# EAGLE design SharkBait (EAGLE 7.1.0)
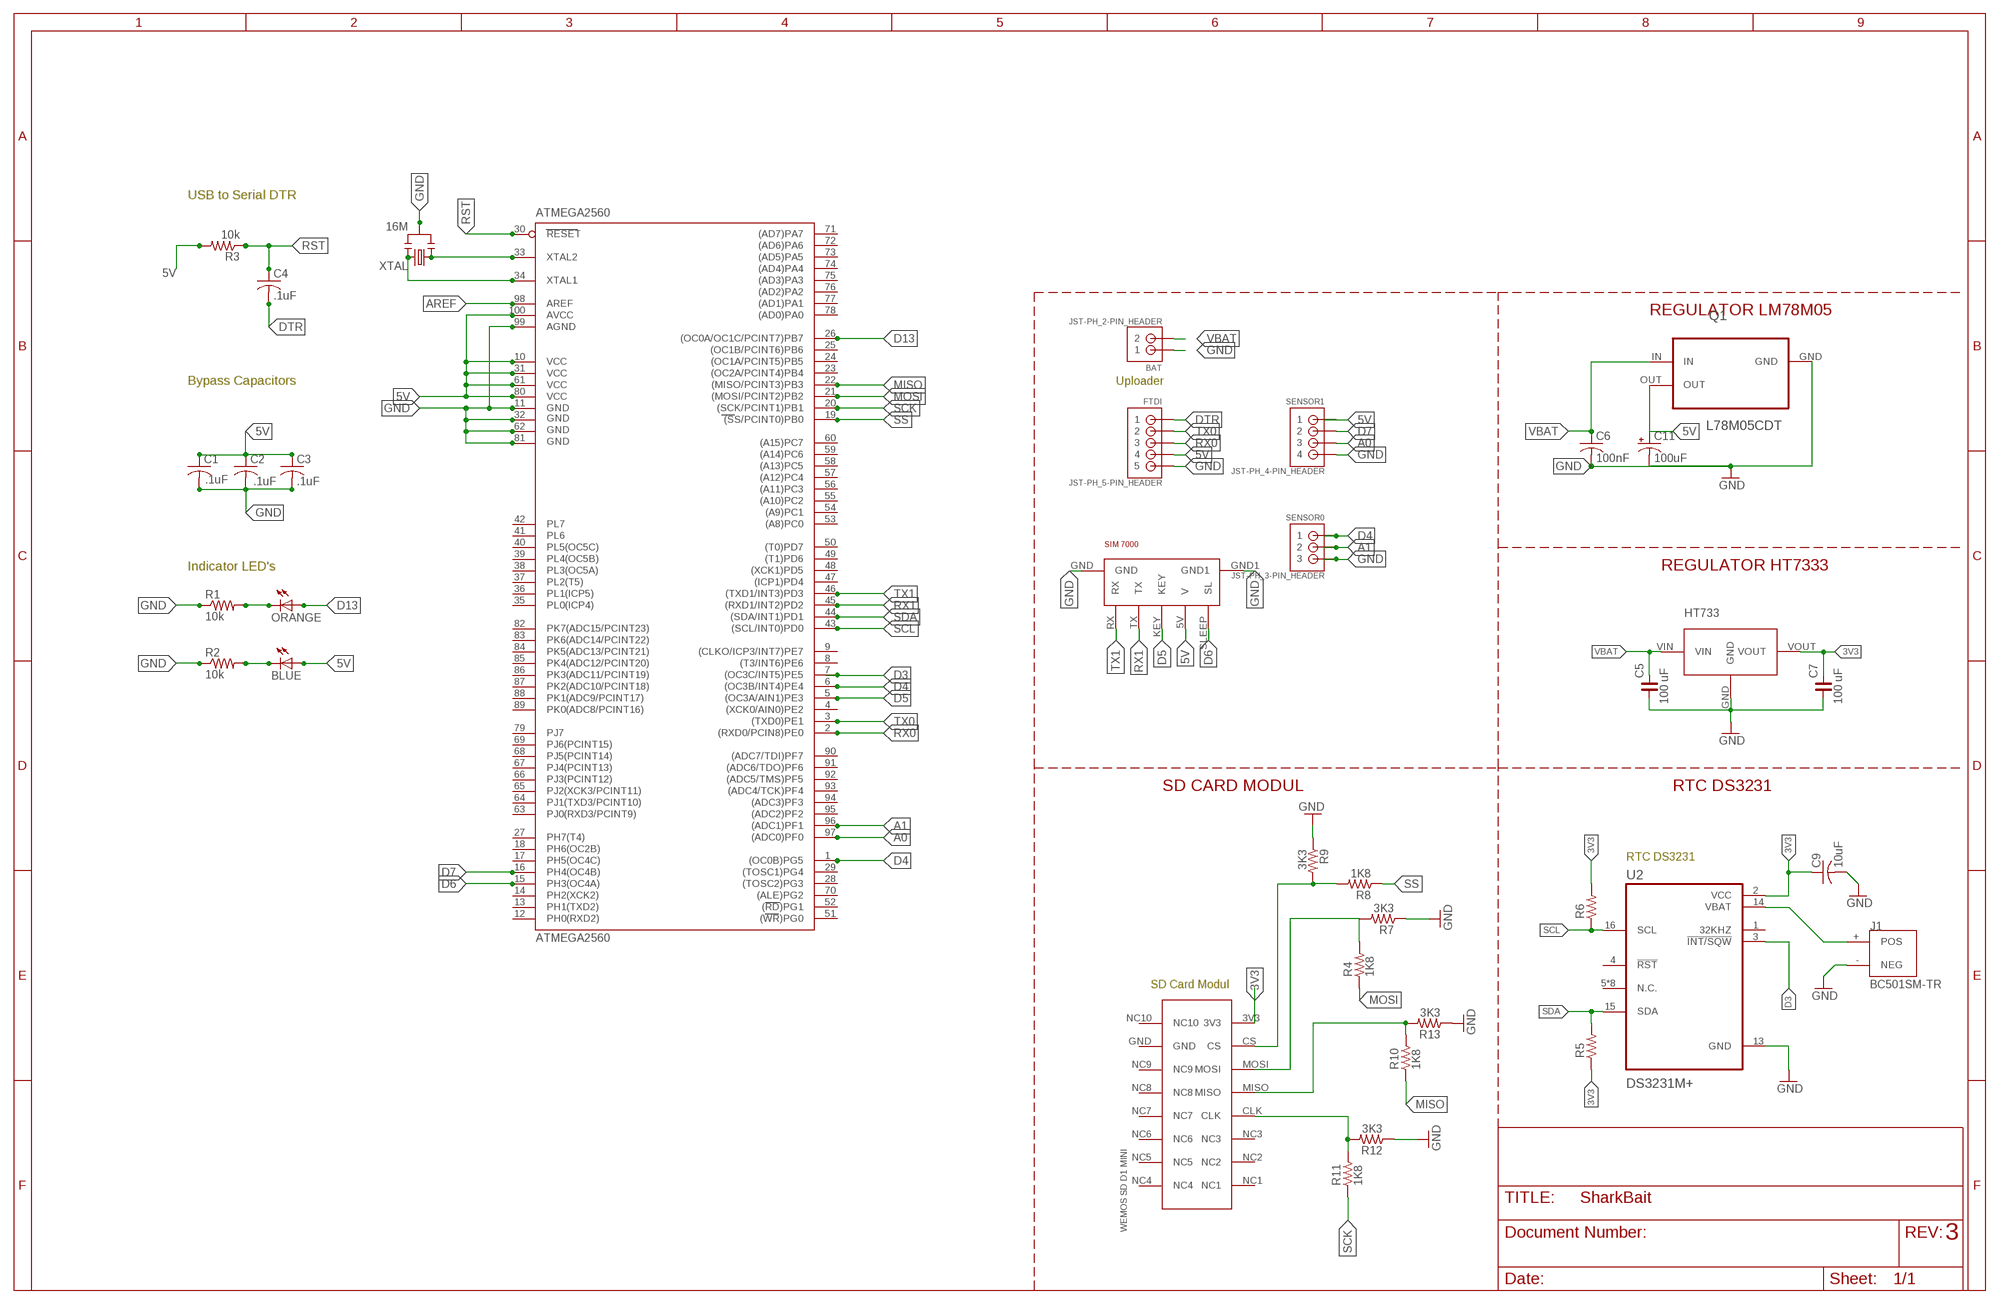
[diagram p0: schematic, sheet 1]

## Parts
ATMEGA2560  ATMEGA2560  [TQFP100]
BAT  JST-PH_2-PIN_HEADER  [JST_B2B-PH_HEADER]
BLUE  L  LED-SMD-0805  [SMD-0805-LED]
C1  CAPACITOR-SMD-0805  [SMD-0805]
C2  .1uF  CAPACITOR-SMD-0805  [SMD-0805]
C3  .1uF  CAPACITOR-SMD-0805  [SMD-0805]
C4  .1uF  CAPACITOR-SMD-0805  [SMD-0805]
C5  100 uF  C_0805  [C0805]
C6  100nF  C-USC1206  [C1206]
C7  100 uF  C_0805  [C0805]
C9  10uF  CAPACITOR-SMD-0805  [SMD-0805]
C11  100uF  CPOL-USD  [PANASONIC_D]
FTDI  JST-PH_5-PIN_HEADER  [JST_B5B-PH_HEADER]
HT733  HT7333  [SOT89]
J1  BC501SM-TR  [MPD_BC501SM-TR]
ORANGE  L  LED-SMD-0805  [SMD-0805-LED]
Q1  L78M05CDT  [TO225P972X240-3N]
R1  10k  RESISTOR-SMD-0805  [SMD-0805]
R2  10k  RESISTOR-SMD-0805  [SMD-0805]
R3  10k  RESISTOR-SMD-0805  [SMD-0805]
R4  1K8  R_0805  [R0805]
R5  R_0805  [R0805]
R6  R_0805  [R0805]
R7  3K3  R_0805  [R0805]
R8  1K8  R_0805  [R0805]
R9  3K3  R_0805  [R0805]
R10  1K8  R_0805  [R0805]
R11  1K8  R_0805  [R0805]
R12  3K3  R_0805  [R0805]
R13  3K3  R_0805  [R0805]
SENSOR0  JST-PH_3-PIN_HEADER  [JST_B3B-PH_HEADER]
SENSOR1  JST-PH_4-PIN_HEADER  [JST_B4B-PH_HEADER]
U2  DS3231M+  [SOIC127P1032X265-16N]
U$1  WEMOS_SD_D1_MINI  [WEMOS_SD_D1_MINI]
U$2  SIM7000  [SIM_7000]
XTAL  16M  RESONATOR  [RESONATOR]

## Nets
3V3: C7.2 C9.1 HT733.VOUT R5.1 R6.2 U2.2(VCC) U$1.3V3
5V: ATMEGA2560.10(VCC) ATMEGA2560.31(VCC1) ATMEGA2560.61(VCC2) ATMEGA2560.80(VCC3) ATMEGA2560.100(AVCC) BLUE.1(A) C1.1 C2.1 C3.1 C11.+ FTDI.P4 Q1.OUT R3.2 SENSOR1.P1 U$2.5V(V)
A0: ATMEGA2560.97((ADC0)PF0) SENSOR1.P3
A1: ATMEGA2560.96((ADC1)PF1) SENSOR0.P2
AREF: ATMEGA2560.98(AREF)
D3: ATMEGA2560.7((OC3C/INT5)PE5) U2.3(!INT/SQW)
D4: ATMEGA2560.1((OC0B)PG5) ATMEGA2560.6((OC3B/INT4)PE4) SENSOR0.P1
D5: ATMEGA2560.5((OC3A/AIN1)PE3) U$2.KEY
D6: ATMEGA2560.15(PH3(OC4A)) U$2.SLEEP(SL)
D7: ATMEGA2560.16(PH4(OC4B)) SENSOR1.P2
D13: ATMEGA2560.26((OC0A/OC1C/PCINT7)PB7) ORANGE.1(A)
DTR: C4.2 FTDI.P1
GND: ATMEGA2560.11(GND) ATMEGA2560.32(GND1) ATMEGA2560.62(GND2) ATMEGA2560.81(GND3) ATMEGA2560.99(AGND) BAT.P1 C1.2 C2.2 C3.2 C5.1 C6.2 C7.1 C9.2 C11.- FTDI.P5 HT733.GND J1.-(NEG) Q1.GND R1.1 R2.1 R7.1 R9.1 R12.1 R13.1 SENSOR0.P3 SENSOR1.P4 U2.13(GND) U$2.GND U$2.GND1 XTAL.2
MISO: ATMEGA2560.22((MISO/PCINT3)PB3) R10.1 R10.2 R13.2 U$1.MISO
MOSI: ATMEGA2560.21((MOSI/PCINT2)PB2) R4.1
N$1: J1.+(POS) U2.14(VBAT)
N$3: R4.2 R7.2 U$1.MOSI
N$13: ATMEGA2560.34(XTAL1) XTAL.3
N$81: ATMEGA2560.33(XTAL2) XTAL.1
N$82: ORANGE.2(C) R1.2
N$83: BLUE.2(C) R2.2
RST: ATMEGA2560.30(RESET) C4.1 R3.1
RX0: ATMEGA2560.2((RXD0/PCIN8)PE0) FTDI.P3
RX1: ATMEGA2560.45((RXD1/INT2)PD2) U$2.TX
SCK: ATMEGA2560.20((SCK/PCINT1)PB1) R11.1 R11.2 R12.2 U$1.CLK
SCK1: R8.2 R9.2 U$1.CS
SCL: ATMEGA2560.43((SCL/INT0)PD0) R6.1 U2.16(SCL)
SDA: ATMEGA2560.44((SDA/INT1)PD1) R5.2 U2.15(SDA)
SS: ATMEGA2560.19((SS/PCINT0)PB0) R8.1
TX0: ATMEGA2560.3((TXD0)PE1) FTDI.P2
TX1: ATMEGA2560.46((TXD1/INT3)PD3) U$2.RX
VBAT: BAT.P2 C5.2 C6.1 HT733.VIN Q1.IN
Unconnected: ATMEGA2560.4((XCK0/AIN0)PE2) ATMEGA2560.8((T3/INT6)PE6) ATMEGA2560.9((CLKO/ICP3/INT7)PE7) ATMEGA2560.12(PH0(RXD2)) ATMEGA2560.13(PH1(TXD2)) ATMEGA2560.14(PH2(XCK2)) ATMEGA2560.17(PH5(OC4C)) ATMEGA2560.18(PH6(OC2B)) ATMEGA2560.23((OC2A/PCINT4)PB4) ATMEGA2560.24((OC1A/PCINT5)PB5) ATMEGA2560.25((OC1B/PCINT6)PB6) ATMEGA2560.27(PH7(T4)) ATMEGA2560.28((TOSC2)PG3) ATMEGA2560.29((TOSC1)PG4) ATMEGA2560.35(PL0(ICP4)) ATMEGA2560.36(PL1(ICP5)) ATMEGA2560.37(PL2(T5)) ATMEGA2560.38(PL3(OC5A)) ATMEGA2560.39(PL4(OC5B)) ATMEGA2560.40(PL5(OC5C)) ATMEGA2560.41(PL6) ATMEGA2560.42(PL7) ATMEGA2560.47((ICP1)PD4) ATMEGA2560.48((XCK1)PD5) ATMEGA2560.49((T1)PD6) ATMEGA2560.50((T0)PD7) ATMEGA2560.51((WR)PG0) ATMEGA2560.52((RD)PG1) ATMEGA2560.53((A8)PC0) ATMEGA2560.54((A9)PC1) ATMEGA2560.55((A10)PC2) ATMEGA2560.56((A11)PC3) ATMEGA2560.57((A12)PC4) ATMEGA2560.58((A13)PC5) ATMEGA2560.59((A14)PC6) ATMEGA2560.60((A15)PC7) ATMEGA2560.63(PJ0(RXD3/PCINT9)) ATMEGA2560.64(PJ1(TXD3/PCINT10)) ATMEGA2560.65(PJ2(XCK3/PCINT11)) ATMEGA2560.66(PJ3(PCINT12)) ATMEGA2560.67(PJ4(PCINT13)) ATMEGA2560.68(PJ5(PCINT14)) ATMEGA2560.69(PJ6(PCINT15)) ATMEGA2560.70((ALE)PG2) ATMEGA2560.71((AD7)PA7) ATMEGA2560.72((AD6)PA6) ATMEGA2560.73((AD5)PA5) ATMEGA2560.74((AD4)PA4) ATMEGA2560.75((AD3)PA3) ATMEGA2560.76((AD2)PA2) ATMEGA2560.77((AD1)PA1) ATMEGA2560.78((AD0)PA0) ATMEGA2560.79(PJ7) ATMEGA2560.82(PK7(ADC15/PCINT23)) ATMEGA2560.83(PK6(ADC14/PCINT22)) ATMEGA2560.84(PK5(ADC13/PCINT21)) ATMEGA2560.85(PK4(ADC12/PCINT20)) ATMEGA2560.86(PK3(ADC11/PCINT19)) ATMEGA2560.87(PK2(ADC10/PCINT18)) ATMEGA2560.88(PK1(ADC9/PCINT17)) ATMEGA2560.89(PK0(ADC8/PCINT16)) ATMEGA2560.90((ADC7/TDI)PF7) ATMEGA2560.91((ADC6/TDO)PF6) ATMEGA2560.92((ADC5/TMS)PF5) ATMEGA2560.93((ADC4/TCK)PF4) ATMEGA2560.94((ADC3)PF3) ATMEGA2560.95((ADC2)PF2) U2.1(32KHZ) U2.4(!RST) U2.5(N.C.) U2.6(N.C.) U2.7(N.C.) U2.8(N.C.) U2.9(N.C.) U2.10(N.C.) U2.11(N.C.) U2.12(N.C.) U$1.GND U$1.NC1 U$1.NC2 U$1.NC3 U$1.NC4 U$1.NC5 U$1.NC6 U$1.NC7 U$1.NC8 U$1.NC9 U$1.NC10

## Notes on the sheet
- USB to Serial DTR
- REGULATOR LM78M05
- Bypass Capacitors | Uploader
- .1uF
- Indicator LED's | REGULATOR HT7333
- SD CARD MODUL | RTC DS3231
- RTC DS3231
- SD Card Modul
- 3

## Library data of the parts
ATMEGA2560 = Fuzzy:ATMEGA2560
BAT = srg:JST-PH_2-PIN_HEADER: 2-pin JST PH Shrouded Header, top entry P/N B2B-PH-K-S Mating connector PHR-2 Mating cable assembly: Sparkfun PRT-09914 <http://www.sparkfun.com/products/9914>
BLUE ORANGE = Fuzzy:LED-SMD-0805
C1-C4 C9 = Fuzzy:CAPACITOR-SMD-0805
C5 C7 = rc-master-smd:C_: NON-POLARIZED CAP
C6 = rcl:C-US: CAPACITOR, American symbol
C11 = rcl:CPOL-US: POLARIZED CAPACITOR, American symbol
FTDI = srg:JST-PH_5-PIN_HEADER: 5-pin JST PH Shrouded Header, top entry P/N B5B-PH-K-S Mating connector PHR-5 Mating cable assembly: Sparkfun PRT-09917 <http://www.sparkfun.com/products/9917>
HT733 = C_HT7333_SOT89:HT7333
J1 = C_BC501SM-TR:BC501SM-TR: Holder Coin Cell For Cr1220 Smd; AVAILABILITY: Unavailable; DESCRIPTION: Holder Coin Cell For Cr1220 Smd; MF: MPD _Memory; MP: BC501SM-TR; PACKAGE: DFN-8 MPD; PRICE: None
Q1 = C_L78M05CDT:L78M05CDT: Positive voltage regulators; AVAILABILITY: Unavailable; DESCRIPTION: L78M Series 500 mA 5 V Three Terminal Positive Voltage LDO Regulator - TO-252; MF: STMicroelectronics; MP: L78M05CDT-TR; PACKAGE: TO-252-3 STMicroelectronics; PRICE: None
R1-R3 = Fuzzy:RESISTOR-SMD-0805
R4-R13 = rc-master-smd:R_: RESISTOR
SENSOR0 = srg:JST-PH_3-PIN_HEADER: 3-pin JST PH Shrouded Header, top entry P/N B3B-PH-K-S Mating connector PHR-3
SENSOR1 = srg:JST-PH_4-PIN_HEADER: 4-pin JST PH Shrouded Header, top entry P/N B4B-PH-K-S Mating connector PHR-4 Mating cable assembly: Sparkfun PRT-09916 <http://www.sparkfun.com/products/9916>
U2 = C_DS3231M_:DS3231M+; DESCRIPTION: Ic Real Time Clock I2c 16soic - Ds3231m+; DIGI-KEY_PART_NUMBER: DS3231M+-ND; DIGI-KEY_PURCHASE_URL: https://www.digikey.co.id/product-detail/en/maxim-integrated/DS3231M-/DS3231M--ND/2402420?utm_source=snapeda&utm_medium=aggregator&utm_campaign=symbol; MF: Maxim Integrated; MP: DS3231M+; PACKAGE: SOIC-16 Maxim
U$1 = C_WEMOS_SD_D1_MINI:WEMOS_SD_D1_MINI
U$2 = C_SIM7000:SIM7000
XTAL = Fuzzy:RESONATOR

## Board
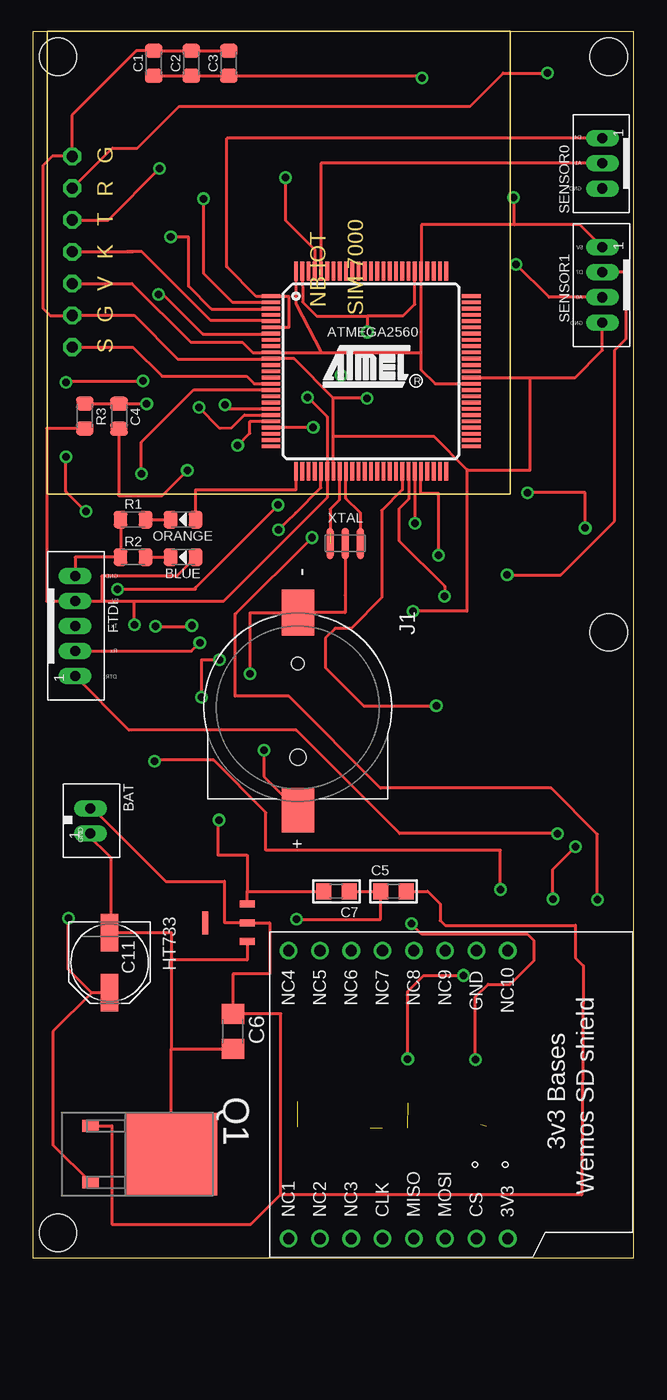
[diagram p1: board, top side]
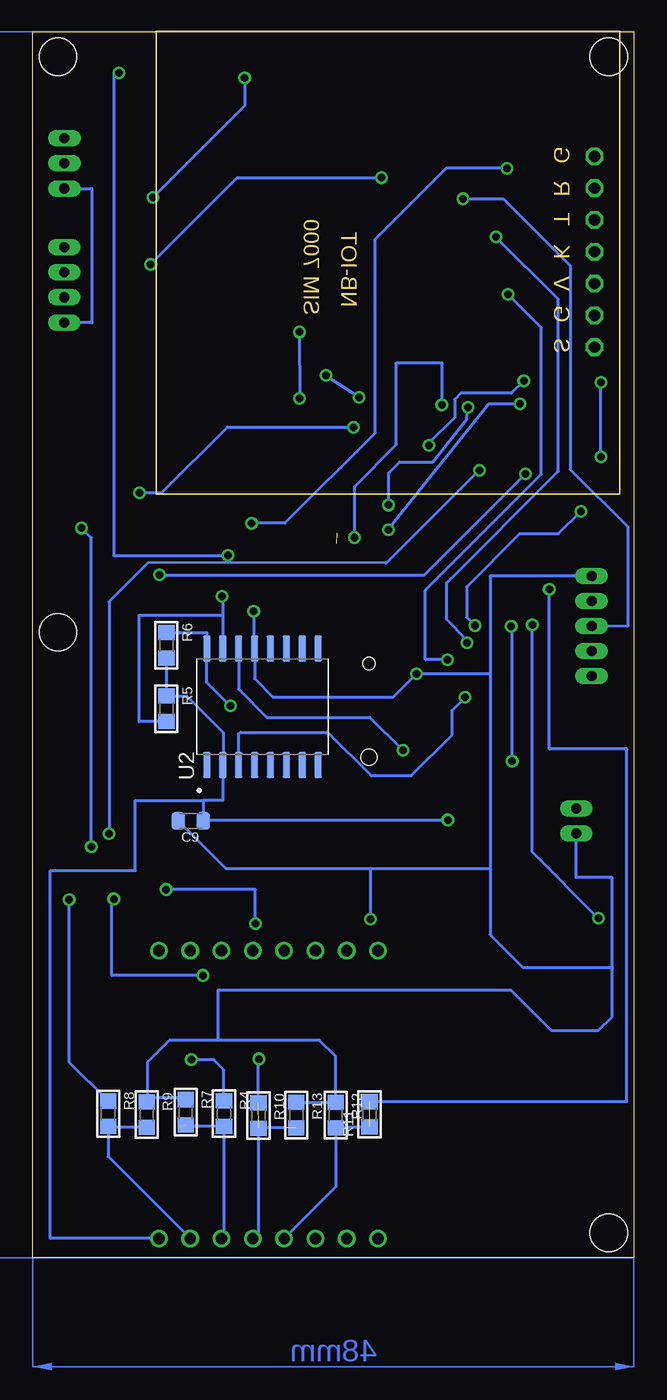
[diagram p2: board, bottom side, seen from below]

Size 48 x 98.03 mm. Coordinates in mm from the lower left corner, seen from the top.
Outline: 0,0 48,0 48,98 0,98 0,0
Copper layers (1*16): Top 0.035mm / dielectric 1.5mm / Bottom 0.035mm
Design rules "default": minimum track width 10mil, minimum drill 24mil, track to track 8mil, track to pad 8mil, pad to pad 8mil, via to via 8mil, smd to smd 8mil, copper to edge 40mil, drill to drill 8mil, minimum pad ring 10mil, minimum via ring 8mil, stop-mask expansion 4mil, vias tented up to drill 0mil, thermal gap 10mil
Holes 3 mm at 2,96 46,96 2,2 46,50

### Footprints (pad centres in the part's own frame; a part is rotated, then mirrored left to right if it is on the bottom)
TQFP100 = smd 1.5 x 0.3: 1 -8,6; 2 -8,5.5; 3 -8,5; 4 -8,4.5; 5 -8,4; 6 -8,3.5; 7 -8,3; 8 -8,2.5; 9 -8,2; 10 -8,1.5; 11 -8,1; 12 -8,0.5; 13 -8,0; 14 -8,-0.5; 15 -8,-1; 16 -8,-1.5; 17 -8,-2; 18 -8,-2.5; 19 -8,-3; 20 -8,-3.5; 21 -8,-4; 22 -8,-4.5; 23 -8,-5; 24 -8,-5.5; 25 -8,-6; 51 8,-6; 52 8,-5.5; 53 8,-5; 54 8,-4.5; 55 8,-4; 56 8,-3.5; 57 8,-3; 58 8,-2.5; 59 8,-2; 60 8,-1.5; 61 8,-1; 62 8,-0.5; 63 8,0; 64 8,0.5; 65 8,1; 66 8,1.5; 67 8,2; 68 8,2.5; 69 8,3; 70 8,3.5; 71 8,4; 72 8,4.5; 73 8,5; 74 8,5.5; 75 8,6 | smd 0.3 x 1.5: 26 -6,-8; 27 -5.5,-8; 28 -5,-8; 29 -4.5,-8; 30 -4,-8; 31 -3.5,-8; 32 -3,-8; 33 -2.5,-8; 34 -2,-8; 35 -1.5,-8; 36 -1,-8; 37 -0.5,-8; 38 0,-8; 39 0.5,-8; 40 1,-8; 41 1.5,-8; 42 2,-8; 43 2.5,-8; 44 3,-8; 45 3.5,-8; 46 4,-8; 47 4.5,-8; 48 5,-8; 49 5.5,-8; 50 6,-8; 76 6,8; 77 5.5,8; 78 5,8; 79 4.5,8; 80 4,8; 81 3.5,8; 82 3,8; 83 2.5,8; 84 2,8; 85 1.5,8; 86 1,8; 87 0.5,8; 88 0,8; 89 -0.5,8; 90 -1,8; 91 -1.5,8; 92 -2,8; 93 -2.5,8; 94 -3,8; 95 -3.5,8; 96 -4,8; 97 -4.5,8; 98 -5,8; 99 -5.5,8; 100 -6,8
JST_B2B-PH_HEADER = drill 0.8 long: P1 1.075,0.048; P2 -0.925,0.048
SMD-0805-LED = smd 1.1 x 1.4: 1 -1,0; 2 1,0
SMD-0805 = smd 1.1 x 1.4: 1 -1,0; 2 1,0
C0805 = smd 1.2 x 1.3: 1 -1.016,0; 2 1.016,0
C1206 = smd 1.6 x 1.8: 1 -1.4,0; 2 1.4,0
PANASONIC_D = smd 3 x 1.4: + 2.4,0; - -2.4,0
JST_B5B-PH_HEADER = drill 0.8 long: P1 4,0.048; P2 2,0.048; P3 0,0.048; P4 -2,0.048; P5 -4,0.048
SOT89 = smd 0.559 x 1.194: GND -1.499,-0.597; VIN 0,-0.597; VOUT 1.499,-0.597 | smd 1.829 x 0.457: P$4 0,2.743
MPD_BC501SM-TR = smd 3.54 x 2.6: + 8.23,0 | smd 3.66 x 2.6: - -7.57,0 | hole 1: -3.5,0 | hole 1.3: 4,0
TO225P972X240-3N = smd 6.604 x 7.315: GND 0,0.152 | smd 0.94 x 1.321: IN -2.261,-6.299; OUT 2.261,-6.299
R0805 = smd 1.2 x 1.3: 1 -1.016,0; 2 1.016,0
JST_B3B-PH_HEADER = drill 0.8 long: P1 2.027,0.048; P2 0.028,0.048; P3 -1.972,0.048
JST_B4B-PH_HEADER = drill 0.8 long: P1 2.98,0.048; P2 0.98,0.048; P3 -1.02,0.048; P4 -3.02,0.048
SOIC127P1032X265-16N = smd 2.05 x 0.59: 1 -4.655,4.445; 2 -4.655,3.175; 3 -4.655,1.905; 4 -4.655,0.635; 5 -4.655,-0.635; 6 -4.655,-1.905; 7 -4.655,-3.175; 8 -4.655,-4.445; 9 4.655,-4.445; 10 4.655,-3.175; 11 4.655,-1.905; 12 4.655,-0.635; 13 4.655,0.635; 14 4.655,1.905; 15 4.655,3.175; 16 4.655,4.445
WEMOS_SD_D1_MINI = drill 0.9: 3V3 1.5,10; CLK 1.5,20; CS 1.5,12.5; GND 24.5,12.5; MISO 1.5,17.5; MOSI 1.5,15; NC1 1.5,27.5; NC2 1.5,25; NC3 1.5,22.5; NC4 24.5,27.5; NC5 24.5,25; NC6 24.5,22.5; NC7 24.5,20; NC8 24.5,17.5; NC9 24.5,15; NC10 24.5,10
SIM_7000 = drill 0.9 octagon: 5V 20.16,2; GND 10,2; GND1 22.7,2; KEY 17.62,2; RX 12.54,2; SLEEP 25.24,2; TX 15.08,2
RESONATOR = smd 0.55 x 2.5: 1 -1.2,0; 2 0,0; 3 1.2,0

### Placement (x,y rotation side)
ATMEGA2560  27.01,70.86 0 top
BAT  4.55,35 270 top
BLUE  12,56 180 top
C1  9.65,95.47 90 top
C2  12.65,95.47 90 top
C3  15.65,95.47 90 top
C4  6.88,67.27 270 top
C5  28.8,29.3 0 top
C6  15.97,18.11 270 top
C7  24.24,29.3 180 top
C9  35.39,34.93 180 bottom
C11  6.13,23.6 270 top
FTDI  3.32,50.49 270 top
HT733  16.51,26.79 90 top
J1  21.16,44 270 top
ORANGE  12,59 180 top
Q1  10.9,8.3 270 top
R1  8,59 0 top
R2  8,56 0 top
R3  4.15,67.29 270 top
R4  32.74,11.55 270 bottom
R5  37.34,43.88 270 bottom
R6  37.34,48.96 270 bottom
R7  35.79,11.64 270 bottom
R8  41.99,11.52 270 bottom
R9  38.91,11.46 270 bottom
R10  29.98,11.37 270 bottom
R11  21.12,11.48 90 bottom
R12  23.81,11.42 270 bottom
R13  26.96,11.41 270 bottom
SENSOR0  45.54,87.44 90 top
SENSOR1  45.55,77.78 90 top
U2  29.66,44.05 90 bottom
U$1  47.93,0.06 90 top
U$2  1.14,98.03 270 top
XTAL  24.95,57.1 0 top

### Tracks (layer width: path | path; a pad name or v marks a point on that pad's centre or on a via)
3V3  (via drill 0.6)
  Top 0.254: HT733.VOUT 17.11,29.3 | 17.11,29.3 C7.2 | v14.86,35 14.77,34.91 14.77,32.19 17.11,32.19 17.11,29.3
  Bottom 0.254: R6.2 R5.1 35.71,44.9 32.81,42 32.81,39.42 U2.2 32.84,36.57 34.39,36.57 | U$1.3V3 46.61,1.56 46.61,30.95 39.82,30.95 39.82,36.57 34.39,36.57 | 34.39,36.57 C9.1 34.39,35 v14.86,35
5V  (via drill 0.6)
  Top 0.254: C11.+ 4.7,21.2 | 4.7,21.2 1.6,18.1 1.6,9.04 Q1.OUT | 23.03,72.36 ATMEGA2560.10 17.55,72.35 16.73,73.17 12.61,73.17 7.91,77.87 U$2.5V | 23.03,72.36 24.6,72.36 | 24.6,72.36 30.99,72.36 31,72.37 | 31,72.37 ATMEGA2560.80 31.02,78.86 31.02,82.57 38.48,82.57 | 31,72.37 31,70.99 32.13,69.86 ATMEGA2560.61 | 5.49,52.48 FTDI.P4 1.09,52.49 1.09,66.29 R3.2 | 5.49,52.48 8.11,52.48 | 8.11,52.48 15.23,52.48 23.51,60.76 ATMEGA2560.31 23.51,67.23 v21.95,68.79 | SENSOR1.P1 43.7,82.57 38.48,82.57 | 4.7,21.2 2.83,23.07 v2.83,27.15 | v8.11,50.61 8.11,52.48 | C3.1 C2.1 C1.1 30.9,94.47 v31.08,94.29 | v38.4,84.76 38.4,82.65 38.48,82.57 | 24.6,72.36 v24.6,70.53 | BLUE.1 11.49,54.49 5.46,54.49 5.49,54.46 5.49,52.48 | ATMEGA2560.100 21.01,76.26 23.03,72.36
  Bottom 0.254: v2.83,27.15 8.11,32.43 v8.11,50.61 | v31.08,94.29 31.08,92.08 v38.4,84.76 | v24.6,70.53 v21.95,68.79
A0  (via drill 0.6)
  Top 0.254: SENSOR1.P3 41.23,76.76 v38.59,79.4 | v20.17,86.33 20.17,82.93 22.51,80.59 ATMEGA2560.97
  Bottom 0.254: v38.59,79.4 31.66,86.33 v20.17,86.33
A1
  Top 0.254: SENSOR0.P2 23.01,87.47 ATMEGA2560.96
D3  (via drill 0.6)
  Top 0.254: v13.48,44.8 13.48,47.81 v14.89,47.81 | v10.04,77 10.41,77 13.57,73.84 18.99,73.84 ATMEGA2560.7
  Bottom 0.254: U2.3 31.57,41.88 31.43,42.01 24.45,42.01 20.99,38.55 17.76,38.55 14.51,41.8 14.51,43.77 v13.48,44.8 | v14.89,47.81 16.65,47.81 16.65,53.37 7.38,62.64 7.38,74.34 v10.04,77
D4
  Top 0.254: SENSOR0.P1 15.5,89.47 15.5,79.23 15.48,79.21 17.85,76.84 19.01,76.84 ATMEGA2560.1 20.44,76.86 20.44,74.36 ATMEGA2560.6
D5
  Top 0.254: U$2.KEY 7.5,80.41 | 7.5,80.41 8.01,80.41 | ATMEGA2560.5 18.96,74.91 14.19,74.91 8.7,80.4 7.51,80.4 7.5,80.41
D6
  Top 0.254: U$2.SLEEP 7.99,72.79 10.32,70.46 17.07,70.46 17.67,69.86 ATMEGA2560.15
D7  (via drill 0.6)
  Top 0.254: v8.66,62.66 8.66,65.19 12.86,69.39 18.98,69.39 ATMEGA2560.16 | v37.89,54.59 42.16,54.59 46.47,58.9 46.47,72.53 47.39,73.45 47.39,78.76 SENSOR1.P2
  Bottom 0.254: v37.89,54.59 16.73,54.59 v8.66,62.66
D13
  Top 0.254: ORANGE.1 12.99,61.39 21.02,61.39 ATMEGA2560.26
DTR  (via drill 0.6)
  Top 0.254: C4.2 6.84,66.27 6.84,60.94 10.34,60.94 v12.33,62.93 | v41.92,33.91 29.29,33.91 21.02,42.18 7.67,42.18 FTDI.P1
  Bottom 0.254: v12.33,62.93 12.42,62.88 19.78,55.52 38.79,55.57 41.92,52.44 v41.92,33.91
GND  (via drill 0.6)
  Top 0.254: BAT.P1 4.28,33.92 6.2,32 6.2,26.07 C11.- 11.05,26 11.05,23.8 | Q1.GND 11.05,16.71 | 11.05,16.71 C6.2 | 11.05,23.8 11.05,16.71 | HT733.GND 17.11,23.8 11.05,23.8 | C7.1 C5.1 27.78,27.07 v21.04,27.07 | ATMEGA2560.32 24.01,65.69 | 24.01,65.69 24.01,68.71 | 24.01,68.71 20.86,71.86 ATMEGA2560.11 19,71.85 11.56,71.85 8.07,75.33 U$2.GND1 3.11,75.3 1.4,75.3 0.8,75.9 0.8,87.3 1.53,88.03 U$2.GND 3.11,88.06 3.11,91.32 8.26,96.47 C1.2 C2.2 C3.2 | ATMEGA2560.99 21.54,76.39 22.66,75.27 26.71,75.27 | ATMEGA2560.81 30.51,76.22 29.56,75.27 26.71,75.27 | 26.71,75.27 v26.71,73.99 | v26.69,68.68 26.66,68.71 24.01,68.71 | 24.95,52.96 XTAL.2 24.95,51.57 J1.- 17.35,51.57 v17.35,46.69 | 34.67,63.02 34.74,62.95 39.72,62.95 39.72,70.33 | 34.67,63.02 32.06,65.63 24.07,65.63 24.01,65.69 | 39.72,70.33 43.29,70.33 45.5,72.54 SENSOR1.P4 | 39.72,70.33 35.04,70.33 ATMEGA2560.62 | 34.67,63.02 34.67,51.69 v30.36,51.69 | R1.1 R2.1 3.37,56 FTDI.P5
  Bottom 0.254: v26.71,73.99 v26.69,68.68 | SENSOR0.P3 43.29,85.47 43.29,74.74 45.5,74.74 SENSOR1.P4 | FTDI.P5 11.48,54.48 11.48,46.66 | 11.48,46.66 17.35,46.66 v17.35,46.69 19.2,44.84 28.83,44.84 30.3,46.3 U2.13 30.36,48.7 v30.36,51.69 | 11.48,46.66 11.48,31.13 | 11.48,31.13 11.48,25.83 8.86,23.21 1.74,23.21 | C9.2 32.59,31.13 21.04,31.13 | 21.04,31.13 11.48,31.13 | R13.1 26.3,12.43 R12.1 23.81,16.1 25.11,17.4 33.22,17.4 | R7.1 35.97,12.84 38.7,12.84 38.91,12.63 R9.1 38.86,12.53 38.86,15.64 37.1,17.4 33.22,17.4 | 1.74,23.21 1.74,30.39 4.6,30.39 BAT.P1 | 33.22,17.4 33.22,21.4 9.79,21.4 6.58,18.19 2.82,18.19 1.74,19.27 1.74,23.1 1.74,23.21 | 21.04,31.13 v21.04,27.07
MISO  (via drill 0.6)  (2 unrouted)
  Top 0.254: v29.94,15.91 29.94,21.3 31.22,22.58 v34.41,22.58 | v41.54,28.69 41.54,31.05 v43.34,32.85 | v44.12,58.33 44.12,61.15 v39.5,61.15 | v22.39,66.37 ATMEGA2560.22
  Bottom 0.254: 27.9,10.39 29.94,10.39 R10.2 29.98,2.01 U$1.MISO | R10.1 29.98,15.87 v29.94,15.91 | v34.41,22.58 41.69,22.58 41.69,28.54 v41.54,28.69 | v43.34,32.85 43.34,57.55 v44.12,58.33 | v39.5,61.15 37.7,61.15 32.44,66.41 22.43,66.41 v22.39,66.37
MOSI  (via drill 0.6)
  Top 0.254: v35.35,15.84 35.35,20.85 36.37,21.87 38.13,21.87 40.03,23.77 40.03,25.34 39.51,25.86 31.08,25.86 v30.23,26.71 | v37.35,29.45 37.35,32.58 18.61,32.58 18.61,35.6 14.43,39.78 9.79,39.78 v9.71,39.7 | v4.23,59.66 2.63,61.26 v2.63,64.02 | v2.63,69.96 2.76,70.09 v8.79,70.09 | v16.36,64.93 17.34,65.91 17.34,66.84 17.36,66.86 ATMEGA2560.21 | v9.79,50.48 12.63,50.48 v12.69,50.54
  Bottom 0.254: R4.1 32.74,15.03 33.55,15.84 v35.35,15.84 | v30.23,26.71 30.23,29.45 v37.35,29.45 | v9.71,39.7 9.71,50.4 v9.79,50.48 | v4.23,59.66 6.02,57.87 9.12,57.87 13.36,53.63 13.36,51.21 v12.69,50.54 | v2.63,64.02 v2.63,69.96 | v8.79,70.09 9.78,69.1 13.82,69.1 14.32,68.6 14.32,67.15 16.36,65.11 v16.36,64.93
N$1  (via drill 0.6)
  Top 0.254: v18.45,40.58 18.45,38.48 J1.+
  Bottom 0.254: U2.14 31.57,45.45 29.32,43.21 21.08,43.21 v18.45,40.58
N$3  (1 unrouted)
  Bottom 0.254: 36.29,10.46 36.22,10.53 R4.2 32.74,1.75 U$1.MOSI
N$13
  Top 0.254: ATMEGA2560.34 25,60.7 26.15,59.55 XTAL.3
N$81  (1 unrouted)
  Top 0.254: ATMEGA2560.33 24.5,60.6 23.74,59.84 23.74,57.93
N$82
  Top 0.254: R1.2 ORANGE.2
N$83
  Top 0.254: R2.2 BLUE.2
RST  (via drill 0.6)
  Top 0.254: R3.1 C4.1 9.06,68.27 v9.09,68.24 | v19.61,58.19 20.98,59.53 23,61.55 ATMEGA2560.30
  Bottom 0.254: v9.09,68.24 11.58,68.24 v19.61,58.19
RX0  (via drill 0.6)
  Top 0.254: ATMEGA2560.2 15.95,76.36 13.64,78.67 v13.64,84.65
  Bottom 0.254: v13.64,84.65 10.43,84.65 5.08,79.3 5.08,63.02 0.5,58.44 0.5,50.48 FTDI.P3
RX1  (via drill 0.6)
  Top 0.254: U$2.TX 6,82.95 v10.12,87.07 | v30.52,58.7 30.52,62.85 ATMEGA2560.45
  Bottom 0.254: v10.12,87.07 15,87.07 20.69,81.38 20.69,65.89 27.87,58.71 30.51,58.71 v30.52,58.7
SCK  (via drill 0.6)  (1 unrouted)
  Top 0.254: v6.75,53.44 13,53.44 13,53.59 v19.58,60.17 | ATMEGA2560.20 | 19,67.37 ATMEGA2560.20 | v13.26,67.98 14.94,66.29 15.86,66.32 16.9,67.36 ATMEGA2560.20
  Bottom 0.254: R11.1 23.75,10.46 R12.2 23.81,5.68 U$1.CLK | R11.2 0.56,12.5 0.56,40.66 6.75,40.66 v6.75,53.44 | v19.58,60.17 19.58,62.74 18.71,63.61 16.08,63.61 13.33,67.04 v13.26,67.98
SCK1
  Bottom 0.254: R9.2 41.93,10.44 R8.2 41.99,8.12 U$1.CS
SCL  (via drill 0.6)
  Top 0.254: ATMEGA2560.43 29.51,61.39 27.85,59.73 27.85,52.76 25.41,50.32 24.15,50.32 23.36,49.53 23.36,47.18 26.42,44.12 v32.22,44.12
  Bottom 0.254: v32.22,44.12 34.1,46.01 U2.16 34.1,49.98 R6.1
SDA  (via drill 0.6)
  Top 0.254: ATMEGA2560.44 30.01,60.64 29.23,59.86 29.23,57.33 32.88,53.68 v32.88,52.89
  Bottom 0.254: v32.88,52.89 32.84,52.84 32.84,51.37 | 32.84,51.37 U2.15 | R5.2 39.52,42.86 39.52,51.37 32.84,51.37
SS  (via drill 0.6)
  Top 0.254: v45.1,28.64 45.1,33.85 41.4,37.55 27.76,37.55 20.42,44.89 16.16,44.89 16.16,51.48 16.21,51.48 v22.3,57.57 | ATMEGA2560.19 15.65,67.86 v15.34,68.17
  Bottom 0.254: R8.1 45.1,15.65 v45.1,28.64 | v22.3,57.57 22.3,61.66 18.96,65 18.96,71.54 15.34,71.54 v15.34,68.17
TX0  (via drill 0.6)
  Top 0.254: ATMEGA2560.3 19.01,75.83 14.26,75.83 12.43,77.66 12.43,81.59 v11.01,81.59 | FTDI.P2 12.66,48.49 v13.33,49.16
  Bottom 0.254: v11.01,81.59 6.03,76.61 6.03,62.87 14.96,53.94 14.96,51.03 13.33,49.4 v13.33,49.16
TX1  (via drill 0.6)
  Top 0.254: U$2.RX 6.34,88.69 8.35,88.69 11.7,92.04 34.92,92.04 37.56,94.68 41.1,94.68 v41.12,94.7 | v32.41,56.14 32.41,61.1 31,61.1 ATMEGA2560.46
  Bottom 0.254: v41.12,94.7 41.54,94.7 41.54,56.14 | 41.54,56.1 41.54,56.14 | 41.54,56.14 v32.41,56.14
VBAT
  Top 0.254: Q1.IN 6.3,10.56 6.3,2.7 17.4,2.7 19.8,5.1 | 19.8,5.1 19.8,19.51 C6.1 15.97,22.7 18.9,22.7 18.9,26.79 HT733.VIN 15.3,26.8 15.3,30.1 10.6,30.1 4.78,35.92 BAT.P2 | 19.8,5.1 19.8,5.04 43.83,5.04 43.98,23.34 43.34,23.98 43.34,26.58 32.92,26.58 32.53,26.97 32.53,28.3 31.53,29.3 C5.2
(copper drawn outside any net)
  shapes: Bottom area x2

### Text on the board
tPlace: D4 | A1 | GND | 5V | D7 | A0 | GND | GND | 5V | Tx | Rx | DTR | GND